# EAGLE design Posibus_proto (EAGLE 6.6.0)
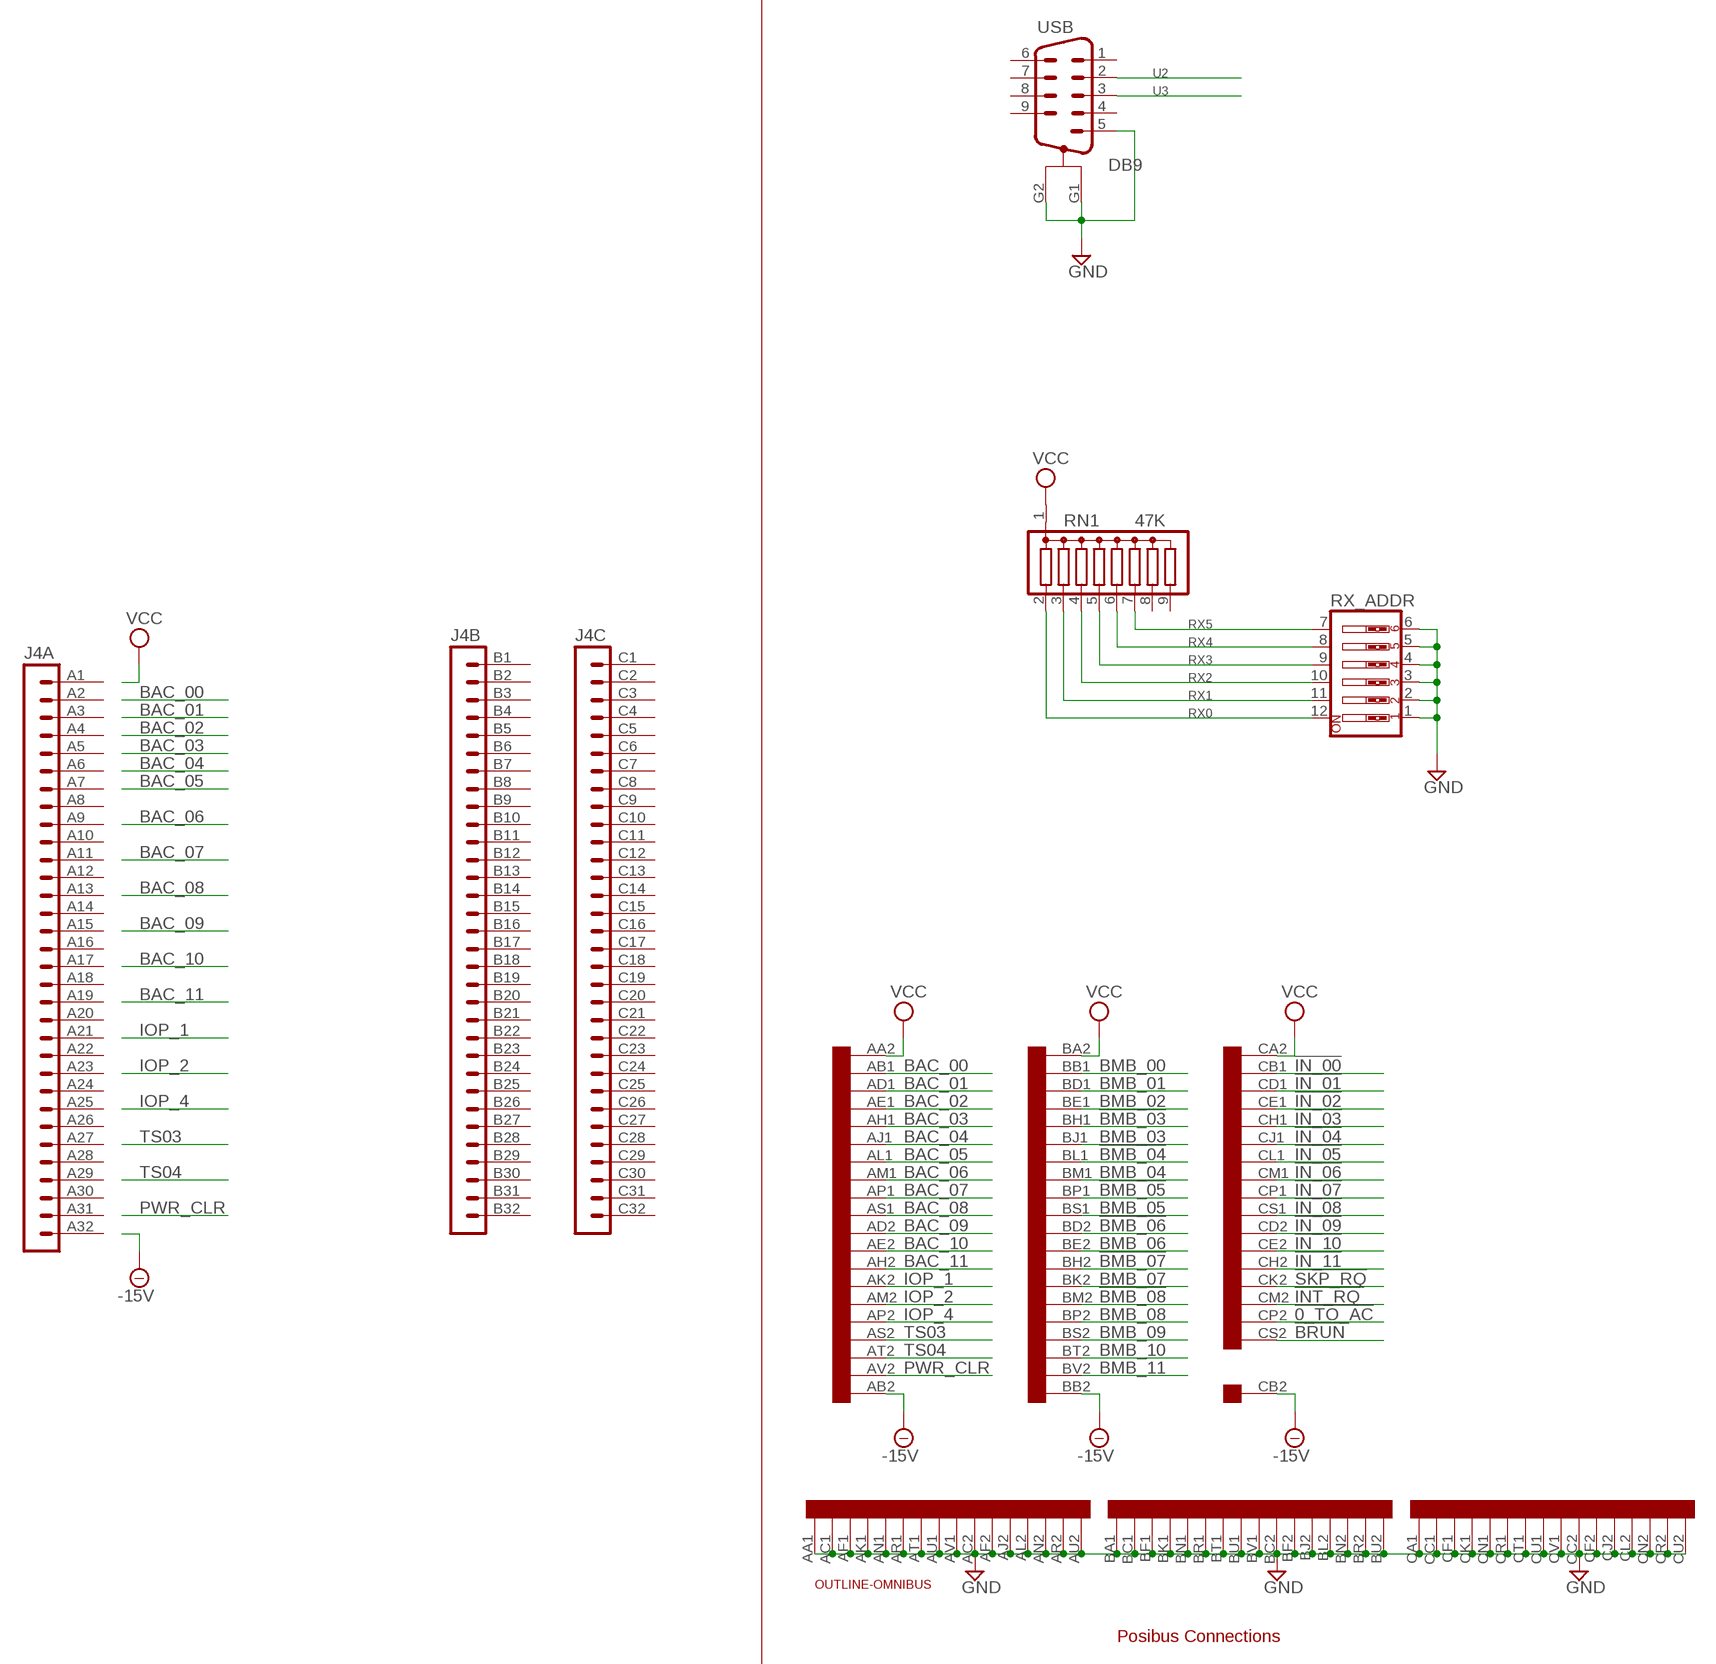
[diagram p0: schematic, sheet 1, part 1 of 2]
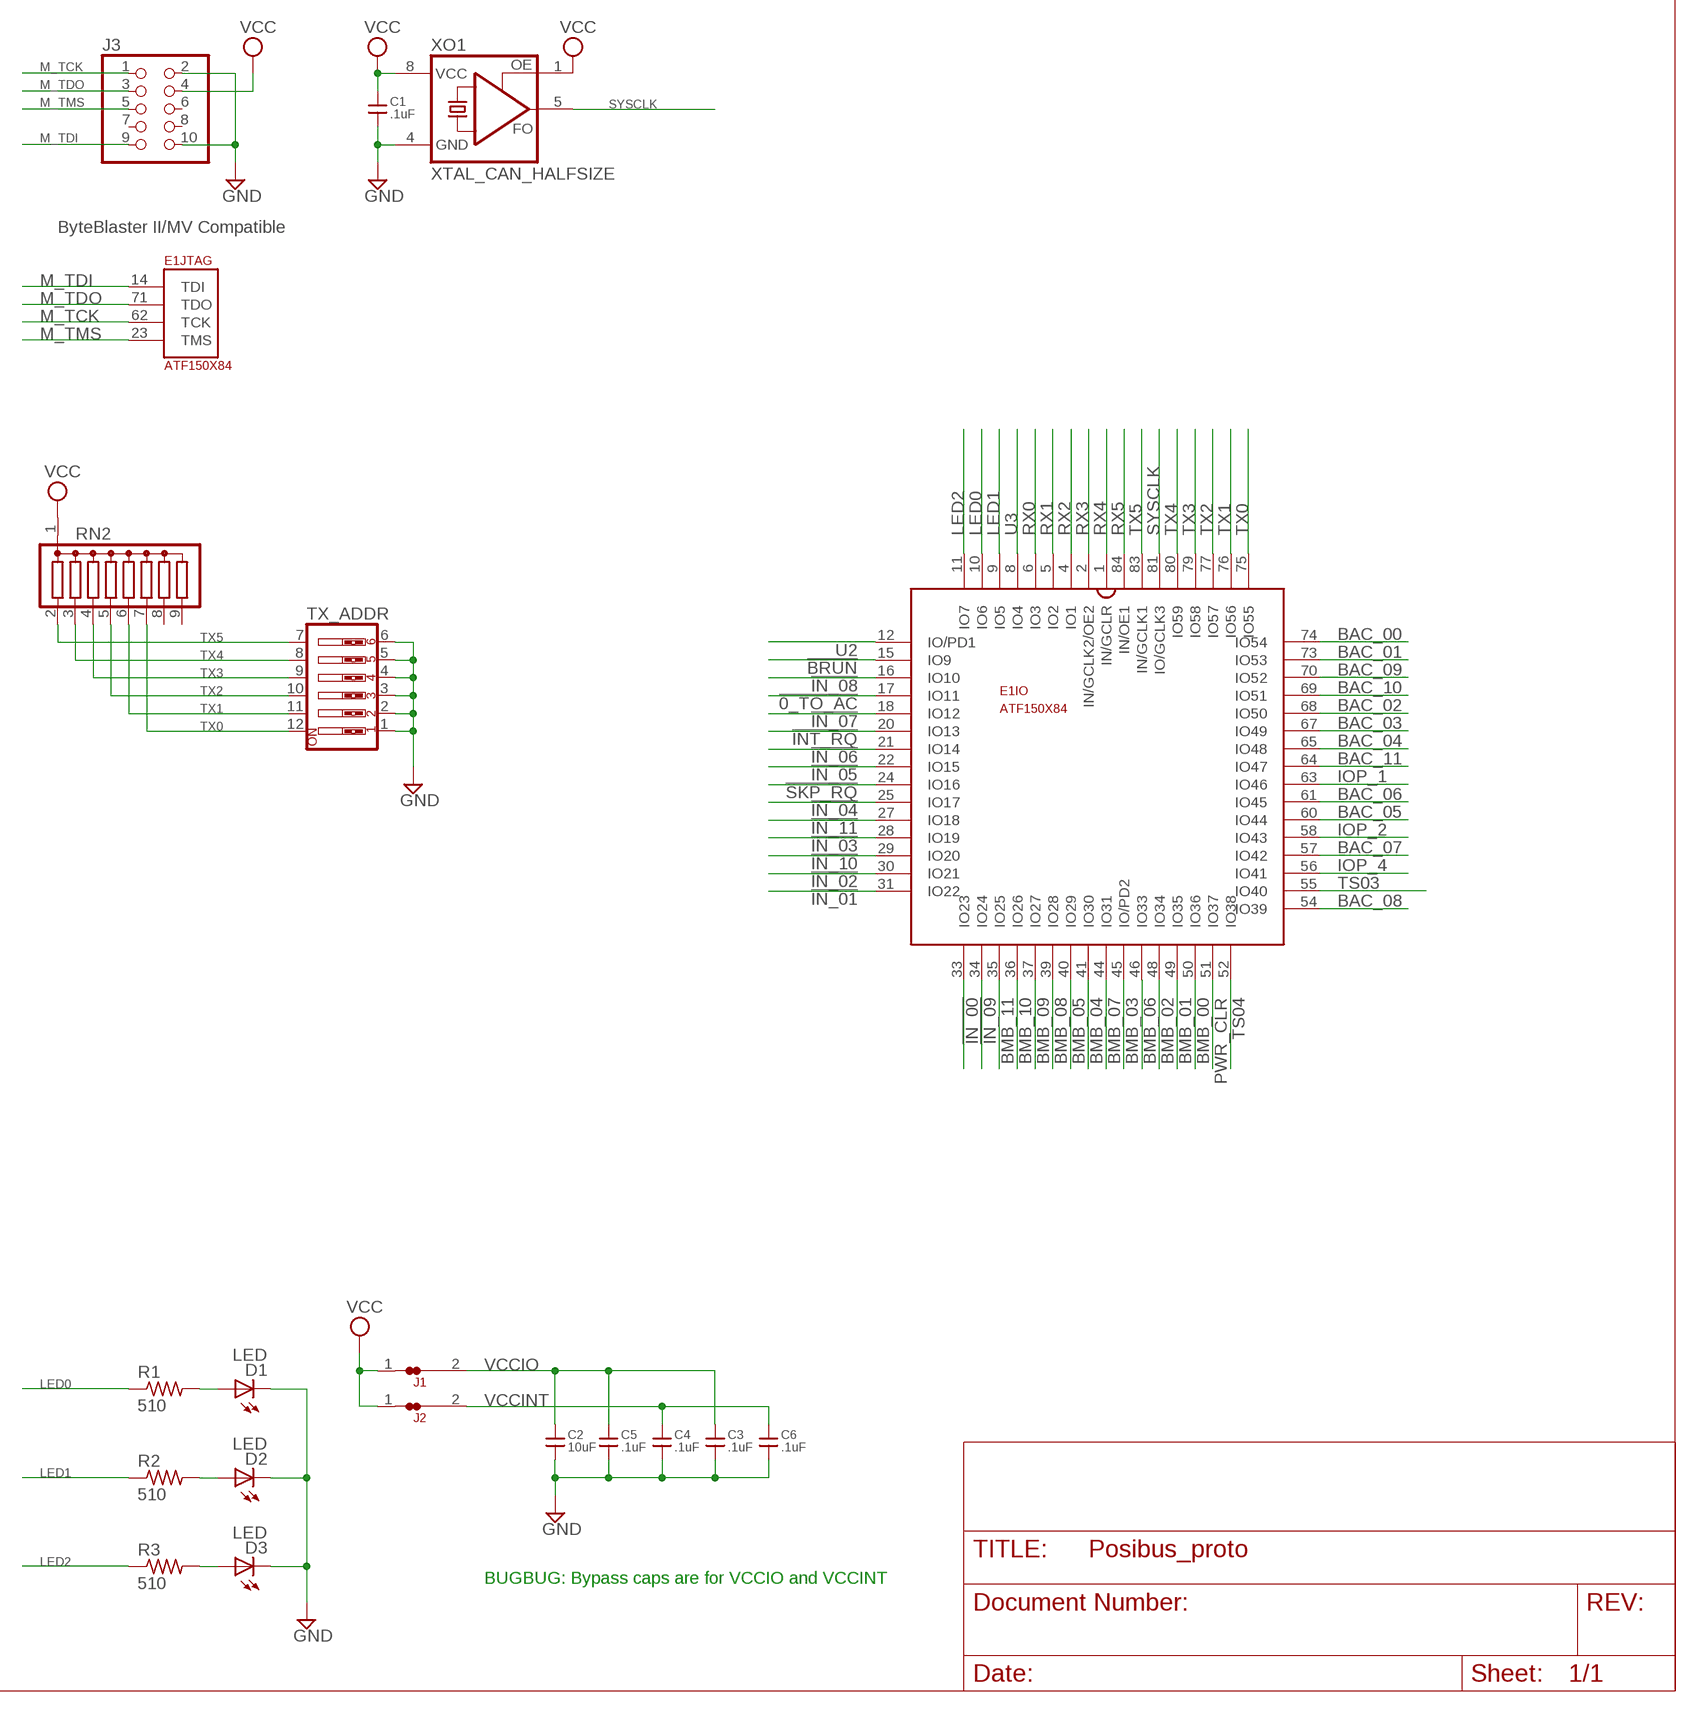
[diagram p1: schematic, sheet 1, part 2 of 2]

## Parts
C1  .1uF  C_US  [C_TH_5MM]
C2  10uF  C_US  [C_TH_5MM]
C3  .1uF  C_US  [C_TH_5MM]
C4  .1uF  C_US  [C_TH_5MM]
C5  .1uF  C_US  [C_TH_5MM]
C6  .1uF  C_US  [C_TH_5MM]
D1  LED  [LED_TH_3MM]
D2  LED  [LED_TH_3MM]
D3  LED  [LED_TH_3MM]
E1  ATF150X84  [S84]
J1  JUMPER-NC1  [NC1]
J2  JUMPER-NC1  [NC1]
J3  HDR_2X5"  [HDR_2X5]
J4  VG96-3B  [VG96B]
R1  510  R_US  [R_204/7]
R2  510  R_US  [R_204/7]
R3  510  R_US  [R_204/7]
RN1  47K  G08R  [SIL9]
RN2  G08R  [SIL9]
RX_ADDR  SW_DIP-6  [EDG-06]
TX_ADDR  SW_DIP-6  [EDG-06]
U$1  QUAD  [EDGE-CON8]
U$2  OUTLINE-OMNIBUS  [OMNIBUS]
USB  DB9  [AMP_DB-9RA]
XO1  XTAL_CAN_HALFSIZE  [XTAL_CAN_HALFSIZE]

## Nets
!0_TO_AC: E1.17(IO:IO11) U$1.CP2
!BMB_03: U$1.BH1
!BMB_04: U$1.BL1
!BMB_05: U$1.BP1
!BMB_06: U$1.BD2
!BMB_07: U$1.BH2
!BMB_08: U$1.BM2
!BRUN: E1.15(IO:IO9) U$1.CS2
!IN_00: E1.33(IO:IO23) U$1.CB1
!IN_01: E1.31(IO:IO22) U$1.CD1
!IN_02: E1.30(IO:IO21) U$1.CE1
!IN_03: E1.28(IO:IO19) U$1.CH1
!IN_04: E1.25(IO:IO17) U$1.CJ1
!IN_05: E1.22(IO:IO15) U$1.CL1
!IN_06: E1.21(IO:IO14) U$1.CM1
!IN_07: E1.18(IO:IO12) U$1.CP1
!IN_08: E1.16(IO:IO10) U$1.CS1
!IN_09: E1.34(IO:IO24) U$1.CD2
!IN_10: E1.29(IO:IO20) U$1.CE2
!IN_11: E1.27(IO:IO18) U$1.CH2
!INT_RQ: E1.20(IO:IO13) U$1.CM2
!SKP_RQ: E1.24(IO:IO16) U$1.CK2
-15V: U$1.AB2 U$1.BB2 U$1.CB2
BAC_00: E1.74(IO:IO54) U$1.AB1
BAC_01: E1.73(IO:IO53) U$1.AD1
BAC_02: E1.68(IO:IO50) U$1.AE1
BAC_03: E1.67(IO:IO49) U$1.AH1
BAC_04: E1.65(IO:IO48) U$1.AJ1
BAC_05: E1.60(IO:IO44) U$1.AL1
BAC_06: E1.61(IO:IO45) U$1.AM1
BAC_07: E1.57(IO:IO42) U$1.AP1
BAC_08: E1.54(IO:IO39) U$1.AS1
BAC_09: E1.70(IO:IO52) U$1.AD2
BAC_10: E1.69(IO:IO51) U$1.AE2
BAC_11: E1.64(IO:IO47) U$1.AH2
BMB_00: E1.50(IO:IO36) U$1.BB1
BMB_01: E1.49(IO:IO35) U$1.BD1
BMB_02: E1.48(IO:IO34) U$1.BE1
BMB_03: E1.45(IO:IO/PD2) U$1.BJ1
BMB_04: E1.41(IO:IO30) U$1.BM1
BMB_05: E1.40(IO:IO29) U$1.BS1
BMB_06: E1.46(IO:IO33) U$1.BE2
BMB_07: E1.44(IO:IO31) U$1.BK2
BMB_08: E1.39(IO:IO28) U$1.BP2
BMB_09: E1.37(IO:IO27) U$1.BS2
BMB_10: E1.36(IO:IO26) U$1.BT2
BMB_11: E1.35(IO:IO25) U$1.BV2
GND: C1.2 C2.2 C3.2 C4.2 C5.2 C6.2 D1.K(C) D2.K(C) D3.K(C) J3.2 J3.10 RX_ADDR.1 RX_ADDR.2 RX_ADDR.3 RX_ADDR.4 RX_ADDR.5 RX_ADDR.6 TX_ADDR.1 TX_ADDR.2 TX_ADDR.3 TX_ADDR.4 TX_ADDR.5 TX_ADDR.6 U$1.AA1 U$1.AC1 U$1.AC2 U$1.AF1 U$1.AF2 U$1.AJ2 U$1.AK1 U$1.AL2 U$1.AN1 U$1.AN2 U$1.AR1 U$1.AR2 U$1.AT1 U$1.AU1 U$1.AU2 U$1.AV1 U$1.BA1 U$1.BC1 U$1.BC2 U$1.BF1 U$1.BF2 U$1.BJ2 U$1.BK1 U$1.BL2 U$1.BN1 U$1.BN2 U$1.BR1 U$1.BR2 U$1.BT1 U$1.BU1 U$1.BU2 U$1.BV1 U$1.CA1 U$1.CC1 U$1.CC2 U$1.CF1 U$1.CF2 U$1.CJ2 U$1.CK1 U$1.CL2 U$1.CN1 U$1.CN2 U$1.CR1 U$1.CR2 U$1.CT1 U$1.CU1 U$1.CU2 U$1.CV1 USB.5 USB.G1 USB.G2 XO1.4(GND)
IOP_1: E1.63(IO:IO46) U$1.AK2
IOP_2: E1.58(IO:IO43) U$1.AM2
IOP_4: E1.56(IO:IO41) U$1.AP2
LED0: E1.10(IO:IO6) R1.1
LED1: E1.9(IO:IO5) R2.1
LED2: E1.11(IO:IO7) R3.1
M_TCK: E1.62(JTAG:TCK) J3.1
M_TDI: E1.14(JTAG:TDI) J3.9
M_TDO: E1.71(JTAG:TDO) J3.3
M_TMS: E1.23(JTAG:TMS) J3.5
N$2: D3.A R3.2
N$3: D2.A R2.2
N$4: D1.A R1.2
PWR_CLR: E1.51(IO:IO37) U$1.AV2
RX0: E1.6(IO:IO3) RN1.2 RX_ADDR.12
RX1: E1.5(IO:IO2) RN1.3 RX_ADDR.11
RX2: E1.4(IO:IO1) RN1.4 RX_ADDR.10
RX3: E1.2(IO:IN/GCLK2/OE2) RN1.5 RX_ADDR.9
RX4: E1.1(IO:IN/GCLR) RN1.6 RX_ADDR.8
RX5: E1.84(IO:IN/OE1) RN1.7 RX_ADDR.7
SYSCLK: E1.81(IO:IO/GCLK3) XO1.5(FO)
TS03: E1.55(IO:IO40) U$1.AS2
TS04: E1.52(IO:IO38) U$1.AT2
TX0: E1.75(IO:IO55) RN2.7 TX_ADDR.12
TX1: E1.76(IO:IO56) RN2.6 TX_ADDR.11
TX2: E1.77(IO:IO57) RN2.5 TX_ADDR.10
TX3: E1.79(IO:IO58) RN2.4 TX_ADDR.9
TX4: E1.80(IO:IO59) RN2.3 TX_ADDR.8
TX5: E1.83(IO:IN/GCLK1) RN2.2 TX_ADDR.7
U2: E1.12(IO:IO/PD1) USB.2
U3: E1.8(IO:IO4) USB.3
VCC: C1.1 J1.1 J2.1 J3.4 RN1.1 RN2.1 U$1.AA2 U$1.BA2 U$1.CA2 XO1.1(OE) XO1.8(VCC)
VCCINT: C4.1 C6.1 J2.2
VCCIO: C2.1 C3.1 C5.1 J1.2
Unconnected: J3.6 J3.7 J3.8 J4.A1 J4.A2 J4.A3 J4.A4 J4.A5 J4.A6 J4.A7 J4.A8 J4.A9 J4.A10 J4.A11 J4.A12 J4.A13 J4.A14 J4.A15 J4.A16 J4.A17 J4.A18 J4.A19 J4.A20 J4.A21 J4.A22 J4.A23 J4.A24 J4.A25 J4.A26 J4.A27 J4.A28 J4.A29 J4.A30 J4.A31 J4.A32 J4.B1 J4.B2 J4.B3 J4.B4 J4.B5 J4.B6 J4.B7 J4.B8 J4.B9 J4.B10 J4.B11 J4.B12 J4.B13 J4.B14 J4.B15 J4.B16 J4.B17 J4.B18 J4.B19 J4.B20 J4.B21 J4.B22 J4.B23 J4.B24 J4.B25 J4.B26 J4.B27 J4.B28 J4.B29 J4.B30 J4.B31 J4.B32 J4.C1 J4.C2 J4.C3 J4.C4 J4.C5 J4.C6 J4.C7 J4.C8 J4.C9 J4.C10 J4.C11 J4.C12 J4.C13 J4.C14 J4.C15 J4.C16 J4.C17 J4.C18 J4.C19 J4.C20 J4.C21 J4.C22 J4.C23 J4.C24 J4.C25 J4.C26 J4.C27 J4.C28 J4.C29 J4.C30 J4.C31 J4.C32 RN1.8 RN1.9 RN2.8 RN2.9 U$1.CT2 U$1.CV2 U$1.DA1 U$1.DA2 U$1.DB1 U$1.DB2 U$1.DC1 U$1.DC2 U$1.DD1 U$1.DD2 U$1.DE1 U$1.DE2 U$1.DF1 U$1.DF2 U$1.DH1 U$1.DH2 U$1.DJ1 U$1.DJ2 U$1.DK1 U$1.DK2 U$1.DL1 U$1.DL2 U$1.DM1 U$1.DM2 U$1.DN1 U$1.DN2 U$1.DP1 U$1.DP2 U$1.DR1 U$1.DR2 U$1.DS1 U$1.DS2 U$1.DT1 U$1.DT2 U$1.DU1 U$1.DU2 U$1.DV1 U$1.DV2 USB.1 USB.4 USB.6 USB.7 USB.8 USB.9

## Notes on the sheet
- ByteBlaster II/MV Compatible
- BUGBUG: Bypass caps are for VCCIO and VCCINT
- Posibus Connections

## Power pins joined to a net without a drawn wire
GND: E1.7(GND) E1.19(GND) E1.32(GND) E1.42(GND) E1.47(GND) E1.59(GND) E1.72(GND) E1.82(GND)
VCCINT: E1.3(VCCINT) E1.43(VCCINT)
VCCIO: E1.13(VCCIO) E1.26(VCCIO) E1.38(VCCIO) E1.53(VCCIO) E1.66(VCCIO) E1.78(VCCIO)

## Library data of the parts
C1-C6 = alan_common:C_US: MLCC Ceramic cap
D1-D3 = alan_common:LED
E1 = atmel-cpld:ATF150X84: ATF150x in 84 pin package.
J1 J2 = dec-con:JUMPER: Normally closed SMD Jumper (Generates a DRC error.)
J3 = alan_common:HDR_2X5: 0.254mm (100 mil) breakaway header - 2 x 5
J4 = 19inch:VG96-3: PCB EUROCARD, 96-pin type C/ABC, 2.54 mm
R1-R3 = alan_common:R_US
RN1 RN2 = resistor-sil:G08R: SIL RESISTOR; OC_FARNELL: unknown; OC_NEWARK: unknown
RX_ADDR TX_ADDR = special:SW_DIP-6: DIP SWITCH
U$1 = dec-con:QUAD: Quad-Height DEC board
U$2 = dec-con:OUTLINE-*: Board outlines for DEC boards.
USB = alan_common:DB9; MANF: TE/AMP; MANF#: 1734352-1; MOUSER#: 571-1734352-1
XO1 = alan_common:XTAL_CAN_HALFSIZE

## Net classes
0 default: width 0.406 mm

## Board
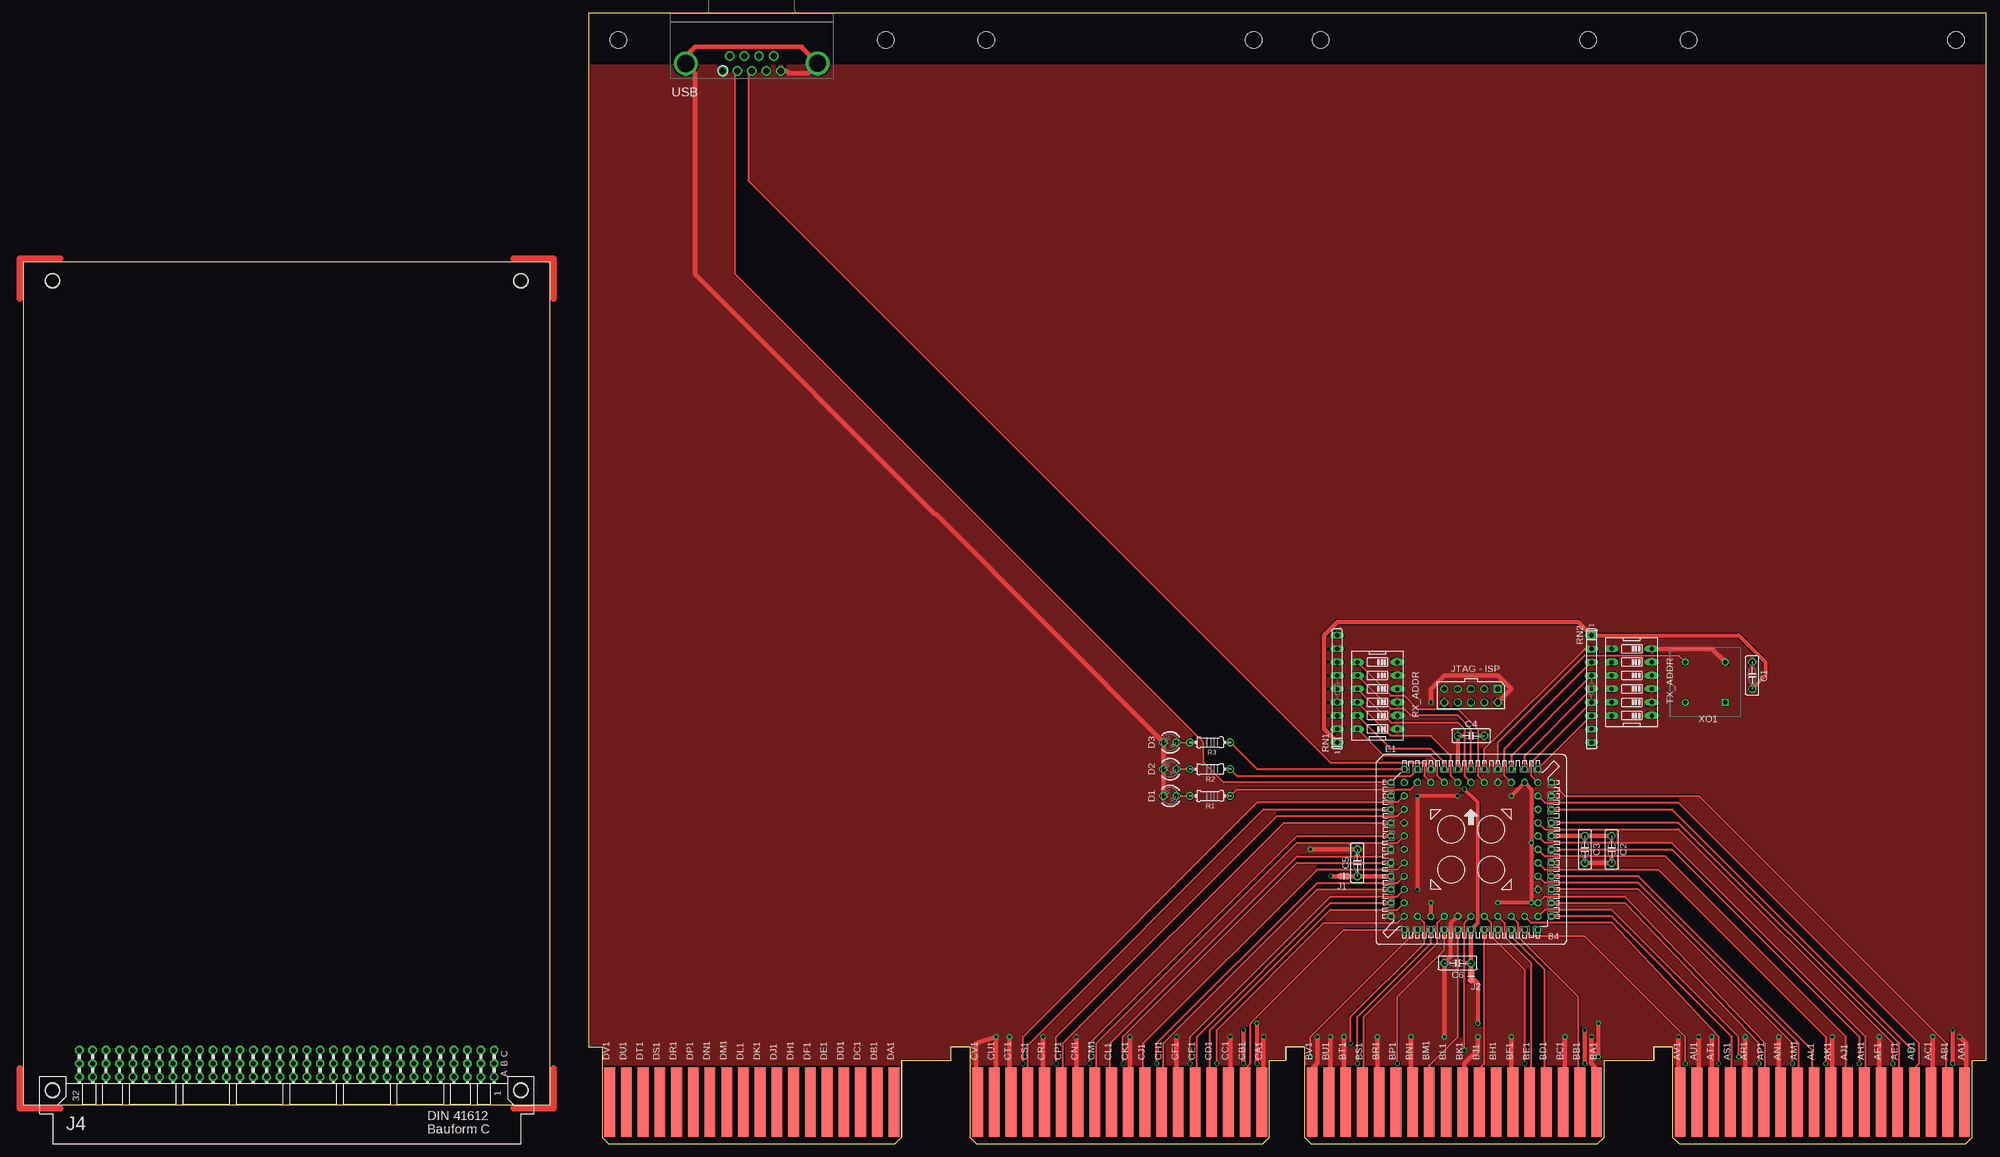
[diagram p2: board, top side]
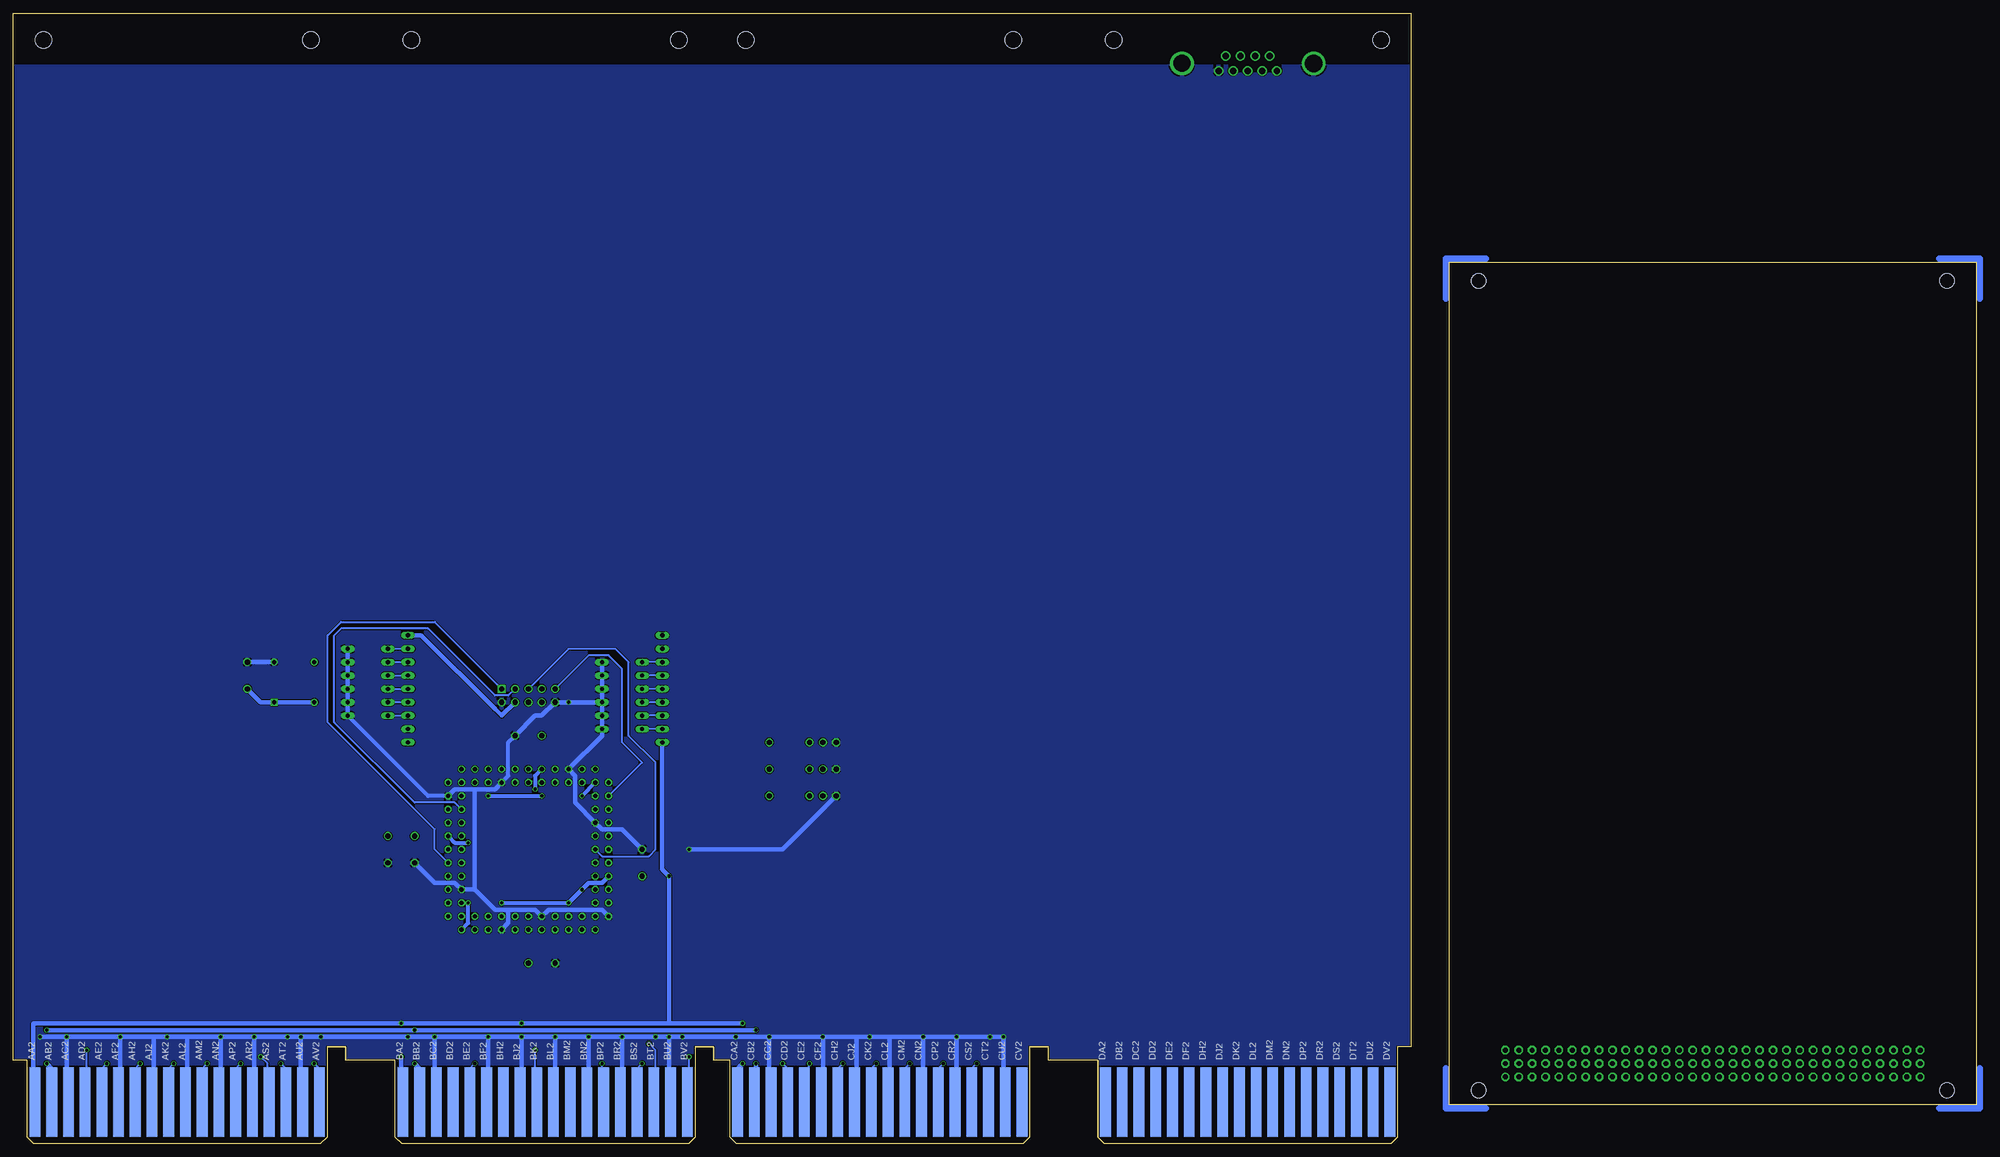
[diagram p3: board, bottom side, seen from below]

Size 372.59 x 214.63 mm. Coordinates in mm from the lower left corner, seen from the top.
Copper layers (1*16): Top 0.035mm / dielectric 1.5mm / Bottom 0.035mm
Design rules "ITEADstudio_DRC": minimum track width 6mil, minimum drill 12mil, track to track 6mil, track to pad 6mil, pad to pad 6mil, via to via 6mil, smd to smd 0mil, copper to edge 10mil, drill to drill 10mil, minimum pad ring 10mil, minimum via ring 6mil, stop-mask expansion 2mil, vias tented up to drill 100mil, thermal gap 10mil

### Footprints (pad centres in the part's own frame; a part is rotated, then mirrored left to right if it is on the bottom)
C_TH_5MM = drill 1: 1 -2.54,0; 2 2.54,0
LED_TH_3MM = drill 1: A -1.27,0 | drill 1 octagon: K 1.27,0
S84 = drill 0.813: 1 0,15.24 | drill 0.813 octagon: 2 0,12.7; 3 -2.54,15.24; 4 -2.54,12.7; 5 -5.08,15.24; 6 -5.08,12.7; 7 -7.62,15.24; 8 -7.62,12.7; 9 -10.16,15.24; 10 -10.16,12.7; 11 -12.7,15.24; 12 -15.24,12.7; 13 -12.7,12.7; 14 -15.24,10.16; 15 -12.7,10.16; 16 -15.24,7.62; 17 -12.7,7.62; 18 -15.24,5.08; 19 -12.7,5.08; 20 -15.24,2.54; 21 -12.7,2.54; 22 -15.24,0; 23 -12.7,0; 24 -15.24,-2.54; 25 -12.7,-2.54; 26 -15.24,-5.08; 27 -12.7,-5.08; 28 -15.24,-7.62; 29 -12.7,-7.62; 30 -15.24,-10.16; 31 -12.7,-10.16; 32 -15.24,-12.7; 33 -12.7,-15.24; 34 -12.7,-12.7; 35 -10.16,-15.24; 36 -10.16,-12.7; 37 -7.62,-15.24; 38 -7.62,-12.7; 39 -5.08,-15.24; 40 -5.08,-12.7; 41 -2.54,-15.24; 42 -2.54,-12.7; 43 0,-15.24; 44 0,-12.7; 45 2.54,-15.24; 46 2.54,-12.7; 47 5.08,-15.24; 48 5.08,-12.7; 49 7.62,-15.24; 50 7.62,-12.7; 51 10.16,-15.24; 52 10.16,-12.7; 53 12.7,-15.24; 54 15.24,-12.7; 55 12.7,-12.7; 56 15.24,-10.16; 57 12.7,-10.16; 58 15.24,-7.62; 59 12.7,-7.62; 60 15.24,-5.08; 61 12.7,-5.08; 62 15.24,-2.54; 63 12.7,-2.54; 64 15.24,0; 65 12.7,0; 66 15.24,2.54; 67 12.7,2.54; 68 15.24,5.08; 69 12.7,5.08; 70 15.24,7.62; 71 12.7,7.62; 72 15.24,10.16; 73 12.7,10.16; 74 15.24,12.7; 75 12.7,15.24; 76 12.7,12.7; 77 10.16,15.24; 78 10.16,12.7; 79 7.62,15.24; 80 7.62,12.7; 81 5.08,15.24; 82 5.08,12.7; 83 2.54,15.24; 84 2.54,12.7
NC1 = smd 1.346 x 1.346: 1 -0.635,0; 2 0.635,0
HDR_2X5 = drill 1 square: 1 -5.08,-1.27 | drill 1: 2 -5.08,1.27; 3 -2.54,-1.27; 4 -2.54,1.27; 5 0,-1.27; 6 0,1.27; 7 2.54,-1.27; 8 2.54,1.27; 9 5.08,-1.27; 10 5.08,1.27
VG96B = drill 0.914 pad 1.6: A1 154.94,39.37 | drill 0.914 pad 1.6 octagon: A2 154.94,36.83; A3 154.94,34.29; A4 154.94,31.75; A5 154.94,29.21; A6 154.94,26.67; A7 154.94,24.13; A8 154.94,21.59; A9 154.94,19.05; A10 154.94,16.51; A11 154.94,13.97; A12 154.94,11.43; A13 154.94,8.89; A14 154.94,6.35; A15 154.94,3.81; A16 154.94,1.27; A17 154.94,-1.27; A18 154.94,-3.81; A19 154.94,-6.35; A20 154.94,-8.89; A21 154.94,-11.43; A22 154.94,-13.97; A23 154.94,-16.51; A24 154.94,-19.05; A25 154.94,-21.59; A26 154.94,-24.13; A27 154.94,-26.67; A28 154.94,-29.21; A29 154.94,-31.75; A30 154.94,-34.29; A31 154.94,-36.83; A32 154.94,-39.37; B1 152.4,39.37; B2 152.4,36.83; B3 152.4,34.29; B4 152.4,31.75; B5 152.4,29.21; B6 152.4,26.67; B7 152.4,24.13; B8 152.4,21.59; B9 152.4,19.05; B10 152.4,16.51; B11 152.4,13.97; B12 152.4,11.43; B13 152.4,8.89; B14 152.4,6.35; B15 152.4,3.81; B16 152.4,1.27; B17 152.4,-1.27; B18 152.4,-3.81; B19 152.4,-6.35; B20 152.4,-8.89; B21 152.4,-11.43; B22 152.4,-13.97; B23 152.4,-16.51; B24 152.4,-19.05; B25 152.4,-21.59; B26 152.4,-24.13; B27 152.4,-26.67; B28 152.4,-29.21; B29 152.4,-31.75; B30 152.4,-34.29; B31 152.4,-36.83; B32 152.4,-39.37; C1 149.86,39.37; C2 149.86,36.83; C3 149.86,34.29; C4 149.86,31.75; C5 149.86,29.21; C6 149.86,26.67; C7 149.86,24.13; C8 149.86,21.59; C9 149.86,19.05; C10 149.86,16.51; C11 149.86,13.97; C12 149.86,11.43; C13 149.86,8.89; C14 149.86,6.35; C15 149.86,3.81; C16 149.86,1.27; C17 149.86,-1.27; C18 149.86,-3.81; C19 149.86,-6.35; C20 149.86,-8.89; C21 149.86,-11.43; C22 149.86,-13.97; C23 149.86,-16.51; C24 149.86,-19.05; C25 149.86,-21.59; C26 149.86,-24.13; C27 149.86,-26.67; C28 149.86,-29.21; C29 149.86,-31.75; C30 149.86,-34.29; C31 149.86,-36.83; C32 149.86,-39.37 | hole 2.794: 157.48,44.45; 157.48,-44.45; 3.81,44.45; 3.81,-44.45
R_204/7 = drill 1: 1 -3.81,0; 2 3.81,0
SIL9 = drill 0.813 long: 1 -10.16,0; 2 -7.62,0; 3 -5.08,0; 4 -2.54,0; 5 0,0; 6 2.54,0; 7 5.08,0; 8 7.62,0; 9 10.16,0
EDG-06 = drill 0.813 long: 1 -6.35,-3.81; 2 -3.81,-3.81; 3 -1.27,-3.81; 4 1.27,-3.81; 5 3.81,-3.81; 6 6.35,-3.81; 7 6.35,3.81; 8 3.81,3.81; 9 1.27,3.81; 10 -1.27,3.81; 11 -3.81,3.81; 12 -6.35,3.81
EDGE-CON8 = smd 2.032 x 13.106: AA1 261.303,7.938; AB1 258.127,7.938; AC1 254.952,7.938; AD1 251.778,7.938; AE1 248.602,7.938; AF1 245.428,7.938; AH1 242.252,7.938; AJ1 239.077,7.938; AK1 235.903,7.938; AL1 232.727,7.938; AM1 229.553,7.938; AN1 226.377,7.938; AP1 223.202,7.938; AR1 220.028,7.938; AS1 216.852,7.938; AT1 213.678,7.938; AU1 210.502,7.938; AV1 207.327,7.938; BA1 191.452,7.938; BB1 188.278,7.938; BC1 185.102,7.938; BD1 181.928,7.938; BE1 178.752,7.938; BF1 175.577,7.938; BH1 172.403,7.938; BJ1 169.227,7.938; BK1 166.053,7.938; BL1 162.877,7.938; BM1 159.702,7.938; BN1 156.528,7.938; BP1 153.352,7.938; BR1 150.178,7.938; BS1 147.002,7.938; BT1 143.827,7.938; BU1 140.653,7.938; BV1 137.477,7.938; CA1 127.953,7.938; CB1 124.778,7.938; CC1 121.603,7.938; CD1 118.427,7.938; CE1 115.252,7.938; CF1 112.078,7.938; CH1 108.903,7.938; CJ1 105.728,7.938; CK1 102.552,7.938; CL1 99.377,7.938; CM1 96.203,7.938; CN1 93.028,7.938; CP1 89.853,7.938; CR1 86.677,7.938; CS1 83.502,7.938; CT1 80.328,7.938; CU1 77.153,7.938; CV1 73.978,7.938; DA1 58.102,7.938; DB1 54.928,7.938; DC1 51.752,7.938; DD1 48.578,7.938; DE1 45.403,7.938; DF1 42.227,7.938; DH1 39.053,7.938; DJ1 35.877,7.938; DK1 32.703,7.938; DL1 29.527,7.938; DM1 26.352,7.938; DN1 23.177,7.938; DP1 20.003,7.938; DR1 16.828,7.938; DS1 13.652,7.938; DT1 10.477,7.938; DU1 7.303,7.938; DV1 4.128,7.938 | smd 2.032 x 13.106 bottom: AA2 261.303,7.938; AB2 258.127,7.938; AC2 254.952,7.938; AD2 251.778,7.938; AE2 248.602,7.938; AF2 245.428,7.938; AH2 242.252,7.938; AJ2 239.077,7.938; AK2 235.903,7.938; AL2 232.727,7.938; AM2 229.553,7.938; AN2 226.377,7.938; AP2 223.202,7.938; AR2 220.028,7.938; AS2 216.852,7.938; AT2 213.678,7.938; AU2 210.502,7.938; AV2 207.327,7.938; BA2 191.452,7.938; BB2 188.278,7.938; BC2 185.102,7.938; BD2 181.928,7.938; BE2 178.752,7.938; BF2 175.577,7.938; BH2 172.403,7.938; BJ2 169.227,7.938; BK2 166.053,7.938; BL2 162.877,7.938; BM2 159.702,7.938; BN2 156.528,7.938; BP2 153.352,7.938; BR2 150.178,7.938; BS2 147.002,7.938; BT2 143.827,7.938; BU2 140.653,7.938; BV2 137.477,7.938; CA2 127.953,7.938; CB2 124.778,7.938; CC2 121.603,7.938; CD2 118.427,7.938; CE2 115.252,7.938; CF2 112.078,7.938; CH2 108.903,7.938; CJ2 105.728,7.938; CK2 102.552,7.938; CL2 99.377,7.938; CM2 96.203,7.938; CN2 93.028,7.938; CP2 89.853,7.938; CR2 86.677,7.938; CS2 83.502,7.938; CT2 80.328,7.938; CU2 77.153,7.938; CV2 73.978,7.938; DA2 58.102,7.938; DB2 54.928,7.938; DC2 51.752,7.938; DD2 48.578,7.938; DE2 45.403,7.938; DF2 42.227,7.938; DH2 39.053,7.938; DJ2 35.877,7.938; DK2 32.703,7.938; DL2 29.527,7.938; DM2 26.352,7.938; DN2 23.177,7.938; DP2 20.003,7.938; DR2 16.828,7.938; DS2 13.652,7.938; DT2 10.477,7.938; DU2 7.303,7.938; DV2 4.128,7.938
OMNIBUS = hole 3.175: 208.915,209.55; 259.715,209.55; 189.865,209.55; 139.065,209.55; 75.616,209.55; 126.416,209.55; 56.566,209.55; 5.766,209.55
AMP_DB-9RA = drill 1.2: 1 -5.54,-1.42; 2 -2.77,-1.42; 3 0,-1.42; 4 2.77,-1.42; 5 5.54,-1.42; 6 -4.155,1.42; 7 -1.385,1.42; 8 1.385,1.42; 9 4.155,1.42 | drill 3.302 pad 4.5: G1 -12.5,0 | drill 3.18 pad 4.5: G2 12.5,0
XTAL_CAN_HALFSIZE = drill 0.8 square: 1 -3.81,-3.81 | drill 0.8: 4 3.81,-3.81; 5 3.81,3.81; 8 -3.81,3.81

### Placement (x,y rotation side)
C1  328.14,88.9 90 top
C2  301.47,55.88 270 top
C3  296.39,55.88 270 top
C4  274.8,77.47 0 top
C5  253.21,53.34 90 top
C6  272.26,34.29 180 top
D1  217.65,66.04 180 top
D2  217.65,71.12 180 top
D3  217.65,76.2 180 top
E1  274.8,55.88 0 top
J1  250.67,50.8 0 top
J2  274.8,31.75 90 top
J3  274.8,85.09 180 top
J4  50.01,167.64 270 top
R1  225.27,66.04 180 top
R2  225.27,71.12 180 top
R3  225.27,76.2 180 top
RN1  249.4,86.36 90 top
RN2  297.66,86.36 270 top
RX_ADDR  257.02,85.09 90 top
TX_ADDR  305.28,87.63 90 top
U$1  107.16,0 0 top
U$2  107.16,0 0 top
USB  138.28,205.1 0 top
XO1  319.25,87.63 90 top

### Tracks (layer width: path | path; a pad name or v marks a point on that pad's centre or on a via)
!0_TO_AC  (via drill 0.6 pad 0.81)
  Top 0.406: v196.06,15.24 196.06,20.32 237.97,62.23 260.83,62.23 E1.17
  Bottom 0.406: U$1.CP2 197.02,8.57 197.33,8.89 197.33,13.97 v196.06,15.24
!BRUN  (via drill 0.6 pad 0.81)
  Top 0.406: v189.71,15.24 189.71,20.32 234.16,64.77 260.83,64.77 E1.15
  Bottom 0.406: U$1.CS2 190.66,8.57 190.98,8.89 190.98,13.97 v189.71,15.24
!IN_00
  Top 0.406: U$1.CB1 231.94,14.29 232.89,15.24 232.89,22.86 250.67,40.64 E1.33
!IN_01
  Top 0.406: U$1.CD1 225.59,8.57 225.27,8.89 225.27,21.59 248.13,44.45 260.83,44.45 E1.31
!IN_02
  Top 0.406: U$1.CE1 222.73,7.62 222.73,20.32 248.13,45.72 E1.30
!IN_03
  Top 0.406: U$1.CH1 216.07,9.84 216.38,10.16 216.38,19.05 245.59,48.26 E1.28
!IN_04
  Top 0.406: U$1.CJ1 212.89,8.57 212.57,8.89 212.57,19.05 245.59,52.07 260.83,52.07 E1.25
!IN_05
  Top 0.406: U$1.CL1 206.54,8.57 206.22,8.89 206.22,19.05 241.78,54.61 258.29,54.61 E1.22
!IN_06
  Top 0.406: U$1.CM1 203.37,8.57 203.68,8.89 203.68,19.05 241.78,57.15 260.83,57.15 E1.21
!IN_07
  Top 0.406: U$1.CP1 197.02,9.84 197.33,10.16 197.33,19.05 239.24,60.96 E1.18
!IN_08
  Top 0.406: U$1.CS1 190.66,18.73 235.43,63.5 E1.16
!IN_09  (via drill 0.6 pad 0.81)
  Top 0.406: v226.54,15.24 226.54,21.59 246.86,41.91 260.83,41.91 E1.34
  Bottom 0.406: U$1.CD2 225.59,8.57 225.27,8.89 225.27,13.97 v226.54,15.24
!IN_10  (via drill 0.6 pad 0.81)
  Top 0.406: v221.46,15.24 221.46,20.32 248.13,46.99 260.83,46.99 E1.29
  Bottom 0.406: U$1.CE2 222.41,8.57 222.73,8.89 v221.46,15.24
!IN_11  (via drill 0.6 pad 0.81)
  Top 0.406: v215.11,15.24 215.11,19.05 245.59,49.53 260.83,49.53 E1.27
  Bottom 0.406: U$1.CH2 216.07,8.57 216.38,8.89 216.38,13.97 v215.11,15.24
!INT_RQ  (via drill 0.6 pad 0.81)
  Top 0.406: v202.41,15.24 202.41,19.05 241.78,58.42 E1.20
  Bottom 0.406: U$1.CM2 203.37,9.84 203.68,10.16 203.68,13.97 v202.41,15.24
!SKP_RQ  (via drill 0.6 pad 0.81)
  Top 0.406: v208.76,15.24 208.76,20.32 241.78,53.34 E1.24
  Bottom 0.406: U$1.CK2 209.71,8.57 210.03,8.89 210.03,13.97 v208.76,15.24
-15V  (via drill 0.6 pad 0.81)
  Top 0.813: v366.24,15.24 v366.24,21.59 | v231.62,15.24 v231.62,21.59 | v296.39,15.24 v296.39,21.59
  Bottom 0.813: U$1.AB2 365.29,8.57 364.97,8.89 364.97,13.97 v366.24,15.24 | v366.24,21.59 v296.39,21.59 v231.62,21.59 | 231.62,10.16 231.62,8.89 231.94,8.57 U$1.CB2 231.94,9.84 231.62,10.16 | 231.62,10.16 v231.62,15.24 | U$1.BB2 295.44,8.57 295.12,8.89 295.12,13.97 v296.39,15.24
BAC_00
  Top 0.406: E1.74 292.58,66.04 317.98,66.04 364.97,19.05 364.97,8.89 365.29,8.57 U$1.AB1
BAC_01
  Top 0.406: E1.73 288.77,64.77 314.17,64.77 359.89,19.05 359.89,15.24 358.62,13.97 358.62,8.89 358.94,8.57 U$1.AD1
BAC_02
  Top 0.406: U$1.AE1 355.76,9.84 356.08,10.16 356.08,19.05 314.17,60.96 E1.68
BAC_03
  Top 0.406: U$1.AH1 349.41,11.11 349.73,11.43 349.73,20.32 312.9,57.15 288.77,57.15 E1.67
BAC_04
  Top 0.406: U$1.AJ1 346.24,8.57 345.92,8.89 345.92,20.32 311.63,54.61 288.77,54.61 E1.65
BAC_05
  Top 0.406: U$1.AL1 339.57,7.62 339.57,17.78 306.55,50.8 E1.60
BAC_06
  Top 0.406: U$1.AM1 337.03,7.94 337.03,19.05 306.55,49.53 288.77,49.53 E1.61
BAC_07
  Top 0.406: E1.57 288.77,46.99 304.01,46.99 330.68,19.05 330.68,8.89 330.36,8.57 U$1.AP1
BAC_08
  Top 0.406: U$1.AS1 324.01,8.57 324.33,8.89 324.33,20.32 301.47,43.18 E1.54
BAC_09  (via drill 0.6 pad 0.81)
  Top 0.406: E1.70 312.9,63.5 v358.62,17.78
  Bottom 0.406: U$1.AD2 358.94,8.57 358.62,8.89 v358.62,17.78
BAC_10  (via drill 0.6 pad 0.81)
  Top 0.406: v354.81,15.24 354.81,19.05 314.17,59.69 288.77,59.69 E1.69
  Bottom 0.406: U$1.AE2 355.76,8.57 356.08,8.89 356.08,13.97 v354.81,15.24
BAC_11  (via drill 0.6 pad 0.81)
  Top 0.406: E1.64 312.9,55.88 348.46,20.32 v348.46,15.24
  Bottom 0.406: U$1.AH2 349.41,9.84 349.73,10.16 349.73,13.97 v348.46,15.24
BMB_00
  Top 0.406: U$1.BB1 295.44,9.84 295.12,10.16 295.12,27.94 283.69,39.37 283.69,41.91 E1.50
BMB_01
  Top 0.406: U$1.BD1 289.09,8.57 288.77,8.89 288.77,33.02 282.42,39.37 E1.49
BMB_02
  Top 0.406: U$1.BE1 285.91,8.57 286.23,8.89 286.23,34.29 281.15,39.37 281.15,41.91 E1.48
BMB_03
  Top 0.406: U$1.BJ1 276.39,8.57 276.07,8.89 276.07,13.97 277.34,15.24 E1.45
BMB_04
  Top 0.406: U$1.BM1 266.86,14.92 272.26,20.32 E1.41
BMB_05
  Top 0.406: E1.40 268.45,41.91 268.45,38.1 254.48,24.13 254.48,7.62 U$1.BS1
BMB_06  (via drill 0.6 pad 0.81)
  Top 0.406: v284.96,15.24 284.96,33.02 278.61,39.37 278.61,41.91 E1.46
  Bottom 0.406: 286.23,7.94 U$1.BE2 285.91,8.57 286.23,8.89 286.23,13.97 v284.96,15.24
BMB_07  (via drill 0.6 pad 0.81)
  Top 0.406: v273.53,17.78 273.53,41.91 E1.44
  Bottom 0.406: U$1.BK2 273.22,8.57 273.53,8.89 v273.53,17.78
BMB_08  (via drill 0.6 pad 0.81)
  Top 0.406: v260.83,15.24 260.83,27.94 269.72,36.83 E1.39
  Bottom 0.406: U$1.BP2 260.51,8.57 260.83,8.89 v260.83,15.24
BMB_09  (via drill 0.6 pad 0.81)
  Top 0.406: v253.21,15.24 253.21,24.13 267.18,38.1 E1.37
  Bottom 0.406: U$1.BS2 254.16,8.57 254.48,8.89 254.48,13.97 v253.21,15.24
BMB_10  (via drill 0.6 pad 0.81)
  Top 0.406: v251.94,19.05 251.94,24.13 265.91,38.1 265.91,41.91 E1.36
  Bottom 0.406: U$1.BT2 250.99,8.57 250.67,8.89 250.67,17.78 v251.94,19.05
BMB_11  (via drill 0.6 pad 0.81)
  Top 0.406: v244.32,16.51 244.32,20.32 E1.35
  Bottom 0.406: U$1.BV2 244.64,9.84 244.32,10.16 v244.32,16.51
GND  (via drill 0.6 pad 0.81)
  Top 0.762: C6.2 270.99,35.56 270.99,41.91 E1.42
  Top 0.813: U$1.CA1 235.12,8.57 235.43,8.89 v235.43,20.32 | U$1.BU2 247.82,8.57 248.13,8.89 v248.13,20.32 | v362.43,20.32 362.43,8.89 362.11,8.57 U$1.AC1 | U$1.AA1 368.47,8.57 368.78,8.89 368.78,19.05 v367.51,20.32 | C6.2 v269.72,20.32 | U$1.CV1 180.82,7.62 180.82,19.05 v184.63,20.32 184.63,8.89 184.32,8.57 U$1.CU1 | U$1.CT1 187.49,8.57 187.17,8.89 v187.17,20.32 | U$1.BT1 250.99,8.57 250.67,8.89 v250.67,20.32 | U$1.BR2 257.34,8.57 257.02,8.89 v257.02,20.32 | U$1.BN2 263.69,8.57 263.37,8.89 v263.37,20.32 | U$1.CR2 193.84,8.57 193.52,8.89 v193.52,20.32 | U$1.CN2 200.19,8.57 199.87,8.89 v199.87,20.32 | U$1.CF2 219.24,8.57 218.92,8.89 v218.92,20.32 | U$1.CK1 209.71,8.57 210.03,8.89 v210.03,20.32 | U$1.CC2 228.77,8.57 229.08,8.89 v229.08,20.32 | U$1.BV1 244.64,8.57 244.32,8.89 244.32,13.97 245.59,15.24 v245.59,20.32 | U$1.BK1 273.22,8.57 273.53,8.89 273.53,15.24 276.07,17.78 v276.07,20.32 | U$1.BC2 292.26,8.57 292.58,8.89 v292.58,20.32 | U$1.BF2 282.74,8.57 282.42,8.89 v282.42,20.32 | U$1.BA1 298.61,14.29 297.66,15.24 v297.66,20.32 | U$1.AV1 314.17,7.62 v314.17,20.32 | U$1.AU1 317.66,8.57 317.98,8.89 v317.98,20.32 | U$1.AT1 320.84,8.57 320.52,8.89 v320.52,20.32 | U$1.AN1 333.54,8.57 333.22,8.89 v333.22,20.32 | U$1.AR1 327.19,8.57 326.87,8.89 v326.87,20.32 | U$1.AF1 352.59,8.57 352.27,8.89 v352.27,20.32 | U$1.AK1 343.07,8.57 343.38,8.89 v343.38,20.32 | C3.2 C2.2 | D1.K D2.K D3.K 173.2,119.58 173,119.58 127.48,165.1 127.48,203.2 USB.G1 125.78,206.57 127.48,208.28 147.8,208.28 147.8,208.08 USB.G2 149.07,203.4 149.07,203.2 145.26,203.2 144.78,203.69 USB.5 | C5.2 v244.32,55.88 | J3.2 282.42,86.36 279.88,88.9 269.72,88.9 267.18,86.36 v267.18,83.82
  Top 0.813: TX_ADDR.6 320.52,93.98 XO1.4
  Bottom 0.762: E1.82 278.61,69.85 278.61,76.2 C4.2 | E1.72 293.85,66.04 TX_ADDR.1
  Bottom 0.813: U$1.BL2 270.04,8.57 269.72,8.89 v269.72,20.32 | U$1.BU2 247.82,8.57 248.13,8.89 v248.13,20.32 | v248.13,20.32 v245.59,20.32 v235.43,20.32 v229.08,20.32 | v248.13,20.32 v250.67,20.32 v257.02,20.32 | v257.02,20.32 v263.37,20.32 | v263.37,20.32 v269.72,20.32 | v269.72,20.32 v276.07,20.32 | v276.07,20.32 v282.42,20.32 | v282.42,20.32 v292.58,20.32 | v292.58,20.32 v297.66,20.32 v314.17,20.32 v317.98,20.32 | v317.98,20.32 v320.52,20.32 v326.87,20.32 | v326.87,20.32 v333.22,20.32 | v333.22,20.32 339.57,20.32 | 339.57,20.32 v343.38,20.32 345.92,20.32 | 345.92,20.32 v352.27,20.32 | v352.27,20.32 v362.43,20.32 | v367.51,20.32 v362.43,20.32 | U$1.BN2 263.69,8.57 263.37,8.89 v263.37,20.32 | v193.52,20.32 v187.17,20.32 v184.63,20.32 184.63,8.89 184.32,8.57 U$1.CU1 | v193.52,20.32 v199.87,20.32 | v199.87,20.32 206.22,20.32 | 206.22,20.32 v210.03,20.32 212.57,20.32 | 212.57,20.32 v218.92,20.32 | v218.92,20.32 v229.08,20.32 | U$1.BR2 257.34,8.57 257.02,8.89 v257.02,20.32 | U$1.CR2 193.84,8.57 193.52,8.89 v193.52,20.32 | U$1.CN2 200.19,8.57 199.87,8.89 v199.87,20.32 | U$1.CF2 219.24,8.57 218.92,8.89 v218.92,20.32 | U$1.CJ2 212.89,8.57 212.57,8.89 212.57,20.32 | U$1.CL2 206.54,8.57 206.22,8.89 206.22,20.32 | U$1.CC2 228.77,8.57 229.08,8.89 v229.08,20.32 | U$1.BF2 282.74,8.57 282.42,8.89 v282.42,20.32 | U$1.BJ2 276.39,8.57 276.07,8.89 v276.07,20.32 | U$1.BC2 292.26,8.57 292.58,8.89 v292.58,20.32 | U$1.AU1 317.66,8.57 317.98,8.89 v317.98,20.32 | U$1.AR1 327.19,8.57 326.87,8.89 v326.87,20.32 | U$1.AN1 333.54,8.57 333.22,8.89 v333.22,20.32 | U$1.AF1 352.59,8.57 352.27,8.89 v352.27,20.32 | U$1.AC1 362.11,8.57 362.43,8.89 v362.43,20.32
  Bottom 0.813: U$1.AJ2 346.24,8.57 345.92,8.89 345.92,20.32 | U$1.AL2 339.89,8.57 339.57,8.89 339.57,20.32 | RX_ADDR.6 RX_ADDR.5 RX_ADDR.4 RX_ADDR.3 | RX_ADDR.3 RX_ADDR.2 RX_ADDR.1 260.83,77.47 E1.7 265.91,69.85 265.91,64.77 E1.19 260.83,59.69 257.02,59.69 C5.2 | RX_ADDR.3 v267.18,83.82 J3.10 272.26,81.28 273.53,81.28 C4.2 | v244.32,55.88 226.54,55.88 D1.K | E1.32 260.83,44.45 270.99,44.45 E1.42 273.53,44.45 278.61,44.45 | 278.61,44.45 278.61,41.91 E1.47 | 284.96,48.26 281.15,44.45 278.61,44.45 | C3.2 292.58,49.53 288.77,49.53 E1.59 284.96,48.26 | E1.82 281.15,67.31 284.96,67.31 | 284.96,67.31 288.77,67.31 E1.72 | 284.96,48.26 284.96,67.31 | TX_ADDR.1 TX_ADDR.2 TX_ADDR.3 TX_ADDR.4 TX_ADDR.5 TX_ADDR.6 | XO1.4 C1.2
  pour Top: 107.16,15.24 107.16,204.47 372.59,204.47 372.59,15.24
  pour Bottom: 107.16,15.24 107.16,204.47 372.59,204.47 372.59,15.24
IOP_1  (via drill 0.6 pad 0.81)
  Top 0.406: E1.63 288.77,52.07 310.36,52.07 342.11,20.32 v342.11,15.24
  Bottom 0.406: U$1.AK2 343.07,8.57 343.38,8.89 343.38,13.97 v342.11,15.24
IOP_2  (via drill 0.6 pad 0.81)
  Top 0.406: v335.76,15.24 335.76,19.05 306.55,48.26 E1.58
  Bottom 0.406: U$1.AM2 337.03,7.94 337.03,13.97 v335.76,15.24
IOP_4  (via drill 0.6 pad 0.81)
  Top 0.406: E1.56 304.01,45.72 329.41,19.05 v329.41,15.24
  Bottom 0.406: U$1.AP2 330.36,8.57 330.68,8.89 330.68,13.97 v329.41,15.24
LED0
  Top 0.406: R1.1 230.35,67.31 263.37,67.31 E1.10
LED1
  Top 0.406: R2.1 230.35,69.85 263.37,69.85 E1.9
LED2
  Top 0.406: R3.1 234.16,71.12 E1.11
M_TCK
  Bottom 0.406: E1.62 292.58,55.88 292.58,59.69 312.9,80.01 312.9,96.52 310.36,99.06 292.58,99.06 J3.1
M_TDI
  Bottom 0.406: E1.14 253.21,72.39 257.02,76.2 257.02,90.17 259.56,92.71 263.37,92.71 J3.9
M_TDO
  Bottom 0.406: E1.71 288.77,64.77 296.39,64.77 311.63,80.01 311.63,96.52 310.36,97.79 293.85,97.79 281.15,85.09 278.61,85.09 J3.3
M_TMS
  Bottom 0.406: E1.23 260.83,54.61 251.94,54.61 250.67,55.88 250.67,72.39 255.75,77.47 255.75,91.44 258.29,93.98 267.18,93.98 J3.5
N$2
  Top 0.406: D3.A R3.2
N$3
  Top 0.406: D2.A R2.2
N$4
  Top 0.406: D1.A R1.2
PWR_CLR  (via drill 0.6 pad 0.81)
  Top 0.406: v315.44,15.24 315.44,20.32 296.39,39.37 286.23,39.37 E1.51
  Bottom 0.406: U$1.AV2 314.49,8.57 314.17,8.89 314.17,13.97 v315.44,15.24
RX0
  Top 0.406: E1.6 268.45,69.85 268.45,72.39 267.18,73.66 258.29,73.66 RX_ADDR.12
  Bottom 0.406: RN1.2 RX_ADDR.12
RX1
  Top 0.406: E1.5 269.72,72.39 267.18,74.93 259.56,74.93 RX_ADDR.11
  Bottom 0.406: RN1.3 RX_ADDR.11
RX2
  Top 0.406: E1.4 270.99,69.85 270.99,73.66 267.18,77.47 259.56,77.47 RX_ADDR.10
  Bottom 0.406: RN1.4 RX_ADDR.10
RX3
  Top 0.406: RX_ADDR.9 259.56,80.01 272.26,80.01 273.53,78.74 273.53,69.85 E1.2
  Bottom 0.406: RN1.5 RX_ADDR.9
RX4
  Top 0.406: E1.1 274.8,78.74 272.26,81.28 263.37,81.28 262.1,82.55 259.56,82.55 RX_ADDR.8
  Bottom 0.406: RN1.6 RX_ADDR.8
RX5
  Top 0.406: RX_ADDR.7 259.56,85.09 262.1,85.09 264.64,82.55 272.26,82.55 276.07,78.74 276.07,69.85 E1.84
  Bottom 0.406: RN1.7 RX_ADDR.7
SYSCLK
  Top 0.406: E1.81 279.88,76.2 296.39,92.71 314.17,92.71 XO1.5
TS03  (via drill 0.6 pad 0.81)
  Top 0.406: v325.6,16.51 325.6,20.32 301.47,44.45 288.77,44.45 E1.55
  Bottom 0.406: U$1.AS2 324.01,8.57 324.33,8.89 324.33,15.24 v325.6,16.51
TS04  (via drill 0.6 pad 0.81)
  Top 0.406: v321.79,15.24 321.79,20.32 301.47,41.91 286.23,41.91 E1.52
  Bottom 0.406: U$1.AT2 320.84,8.57 320.52,8.89 320.52,13.97 v321.79,15.24
TX0
  Top 0.406: E1.75 RN2.7
  Bottom 0.406: TX_ADDR.12 RN2.7
TX1
  Top 0.406: E1.76 286.23,69.85 286.23,72.39 RN2.6
  Bottom 0.406: RN2.6 TX_ADDR.11
TX2
  Top 0.406: E1.77 284.96,73.66 RN2.5
  Bottom 0.406: TX_ADDR.10 RN2.5
TX3
  Top 0.406: RN2.4 282.42,73.66 E1.79
  Bottom 0.406: TX_ADDR.9 RN2.4
TX4
  Top 0.406: E1.80 281.15,69.85 281.15,74.93 RN2.3
  Bottom 0.406: TX_ADDR.8 RN2.3
TX5
  Top 0.406: E1.83 277.34,74.93 296.39,93.98 RN2.2
  Bottom 0.406: RN2.2 TX_ADDR.7
U2
  Top 0.406: E1.12 227.81,68.58 224,72.39 224,76.2 135.1,165.1 135.1,203.2 135.51,203.6 USB.2
U3
  Top 0.406: E1.8 265.91,69.85 265.91,72.39 248.13,72.39 137.64,182.88 137.64,203.2 138.13,203.69 USB.3
VCC  (via drill 0.6 pad 0.81)
  Top 0.762: RN2.1 325.6,96.52 330.68,91.44 330.68,88.9 C1.1
  Top 0.813: v298.93,16.51 v298.93,22.86 | v234.16,15.24 v234.16,22.86 | J2.1 275.44,31.11 276.07,30.48 v276.07,22.86 | J1.1 v248.13,50.8 | RN1.1 246.86,78.74 246.86,96.52 249.4,99.06 295.12,99.06 RN2.1
  Bottom 0.406: U$1.BA2 298.61,8.57 298.93,8.89
  Bottom 0.762: 279.88,81.28 281.15,82.55
  Bottom 0.813: 298.93,8.89 v298.93,16.51 | U$1.AA2 368.47,8.57 368.78,8.89 368.78,22.86 v298.93,22.86 v276.07,22.86 248.13,22.86 | 248.13,22.86 v234.16,22.86 | U$1.CA2 235.12,8.57 235.43,8.89 235.43,13.97 v234.16,15.24 | J3.4 279.88,81.28 | 281.15,82.55 295.12,96.52 RN2.1 | RN1.1 249.4,52.07 v248.13,50.8 248.13,22.86 | XO1.8 XO1.1 325.6,83.82 C1.1
VCCINT  (via drill 0.6 pad 0.81)
  Top 0.762: E1.43 276.07,41.91 276.07,64.77 v273.53,67.31
  Top 0.813: E1.43 C6.1 J2.2 | C4.1 E1.3
  Bottom 0.762: E1.3 273.53,69.85 v273.53,67.31
VCCIO  (via drill 0.6 pad 0.81)
  Top 0.762: v279.88,45.72 v286.23,45.72 v286.23,57.15 286.23,67.31 E1.78 v282.42,66.04 | v264.64,48.26 v264.64,66.04 v272.26,66.04
  Top 0.813: E1.26 C5.1 J1.2 | E1.66 C3.1 C2.1 | v267.18,45.72 E1.38
  Bottom 0.762: E1.53 286.23,41.91 v286.23,45.72 | v279.88,45.72 v267.18,45.72 | E1.66 288.77,57.15 v286.23,57.15 | E1.13 v264.64,66.04 | v282.42,66.04 v272.26,66.04
  Bottom 0.813: E1.26 260.83,49.53 263.37,49.53 v264.64,48.26 v267.18,45.72
  pour Top (isolate 0.406): 286.55,67.31 283.69,67.31 282.42,68.58 279.88,66.04 264.64,66.04 264.33,65.72 264.33,48.26 267.5,45.72 286.55,45.72

### Text on the board
tPlace: JTAG - ISP